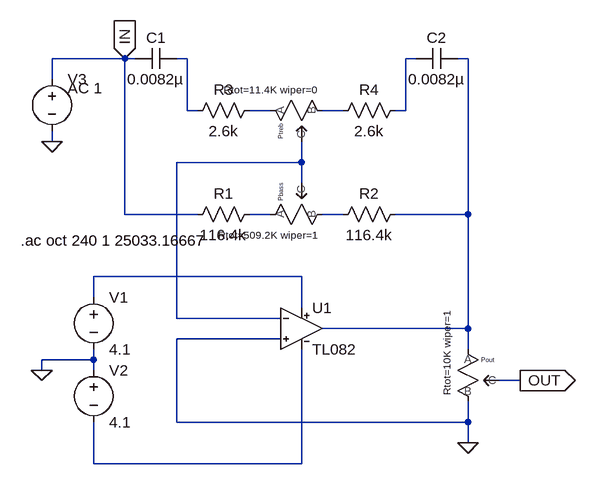
[diagram p0: schematic lmc1992_bass_treb.asc]
lmc1992_bass_treb.asc, the LTspice schematic file:
Version 4.1
SHEET 1 880 680
WIRE -32 -112 -144 -112
WIRE -16 -112 -32 -112
WIRE 64 -112 48 -112
WIRE 416 -112 400 -112
WIRE 496 -112 480 -112
WIRE -144 -80 -144 -112
WIRE 64 -32 64 -112
WIRE 80 -32 64 -32
WIRE 192 -32 160 -32
WIRE 304 -32 272 -32
WIRE 400 -32 400 -112
WIRE 400 -32 384 -32
WIRE -144 16 -144 0
WIRE 240 48 240 16
WIRE 240 48 48 48
WIRE 240 80 240 48
WIRE -32 128 -32 -112
WIRE 80 128 -32 128
WIRE 192 128 160 128
WIRE 304 128 272 128
WIRE 496 128 496 -112
WIRE 496 128 384 128
WIRE 240 224 -80 224
WIRE -80 256 -80 224
WIRE 240 272 240 224
WIRE 48 288 48 48
WIRE 208 288 48 288
WIRE 496 304 496 128
WIRE 496 304 272 304
WIRE 208 320 48 320
WIRE 496 336 496 304
WIRE -80 352 -80 336
WIRE -80 352 -160 352
WIRE -160 368 -160 352
WIRE -80 368 -80 352
WIRE 576 384 544 384
WIRE 48 448 48 320
WIRE 496 448 496 416
WIRE 496 448 48 448
WIRE 496 480 496 448
WIRE -80 512 -80 448
WIRE 240 512 240 336
WIRE 240 512 -80 512
FLAG 496 480 0
FLAG -160 368 0
FLAG -32 -112 IN
IOPIN -32 -112 In
FLAG 576 384 OUT
IOPIN 576 384 Out
FLAG -144 16 0
SYMBOL res 176 112 R90
WINDOW 0 0 56 VBottom 2
WINDOW 3 32 56 VTop 2
SYMATTR InstName R1
SYMATTR Value 116.4k
SYMBOL res 400 112 R90
WINDOW 0 0 56 VBottom 2
WINDOW 3 32 56 VTop 2
SYMATTR InstName R2
SYMATTR Value 116.4k
SYMBOL res 176 -48 R90
WINDOW 0 0 56 VBottom 2
WINDOW 3 32 56 VTop 2
SYMATTR InstName R3
SYMATTR Value 2.6k
SYMBOL res 400 -48 R90
WINDOW 0 0 56 VBottom 2
WINDOW 3 32 56 VTop 2
SYMATTR InstName R4
SYMATTR Value 2.6k
SYMBOL potentiometer 176 -48 M90
SYMATTR InstName Ptreb
SYMATTR Value Rtot=11.4K wiper=0
SYMBOL potentiometer 176 144 R270
SYMATTR InstName Pbass
SYMATTR Value Rtot=509.2K wiper=1
SYMBOL cap 48 -128 R90
WINDOW 0 0 32 VBottom 2
WINDOW 3 32 32 VTop 2
SYMATTR InstName C1
SYMATTR Value 0.0082µ
SYMBOL cap 480 -128 R90
WINDOW 0 0 32 VBottom 2
WINDOW 3 32 32 VTop 2
SYMATTR InstName C2
SYMATTR Value 0.0082µ
SYMBOL potentiometer 480 320 R0
SYMATTR InstName Pout
SYMATTR Value Rtot=10K wiper=1
SYMBOL voltage -80 240 R0
WINDOW 123 0 0 Left 0
WINDOW 39 0 0 Left 0
SYMATTR InstName V1
SYMATTR Value 4.1
SYMBOL voltage -80 352 R0
WINDOW 123 0 0 Left 0
WINDOW 39 0 0 Left 0
SYMATTR InstName V2
SYMATTR Value 4.1
SYMBOL voltage -144 -96 R0
WINDOW 123 24 30 Left 2
WINDOW 39 0 0 Left 0
SYMATTR Value2 AC 1
SYMATTR InstName V3
SYMATTR Value ""
SYMBOL TL082 240 240 R0
SYMATTR InstName U1
TEXT -192 168 Left 2 !.ac oct 240 1 25033.16667

The netlist it stands for:
* lmc1992_bass_treb.asc
R1 N007 IN 116.4k
R2 N003 N008 116.4k
R3 N004 N001 2.6k
R4 N002 N005 2.6k
X§Ptreb N004 N005 N006 potentiometer Rtot=11.4K wiper=0  ; pins A B C
X§Pbass N007 N008 N006 potentiometer Rtot=509.2K wiper=1  ; pins A B C
C1 N001 IN 0.0082µ
C2 N003 N002 0.0082µ
X§Pout N003 0 OUT potentiometer Rtot=10K wiper=1  ; pins A B C
V1 N009 0 4.1
V2 0 N010 4.1
V3 IN 0 AC 1
X§U1 0 N006 N009 N010 N003 TL082  ; pins In+ In- V+ V- OUT
.ac oct 240 1 25033.16667
.lib potentiometer.sub
.lib TL082.sub
.backanno
.end